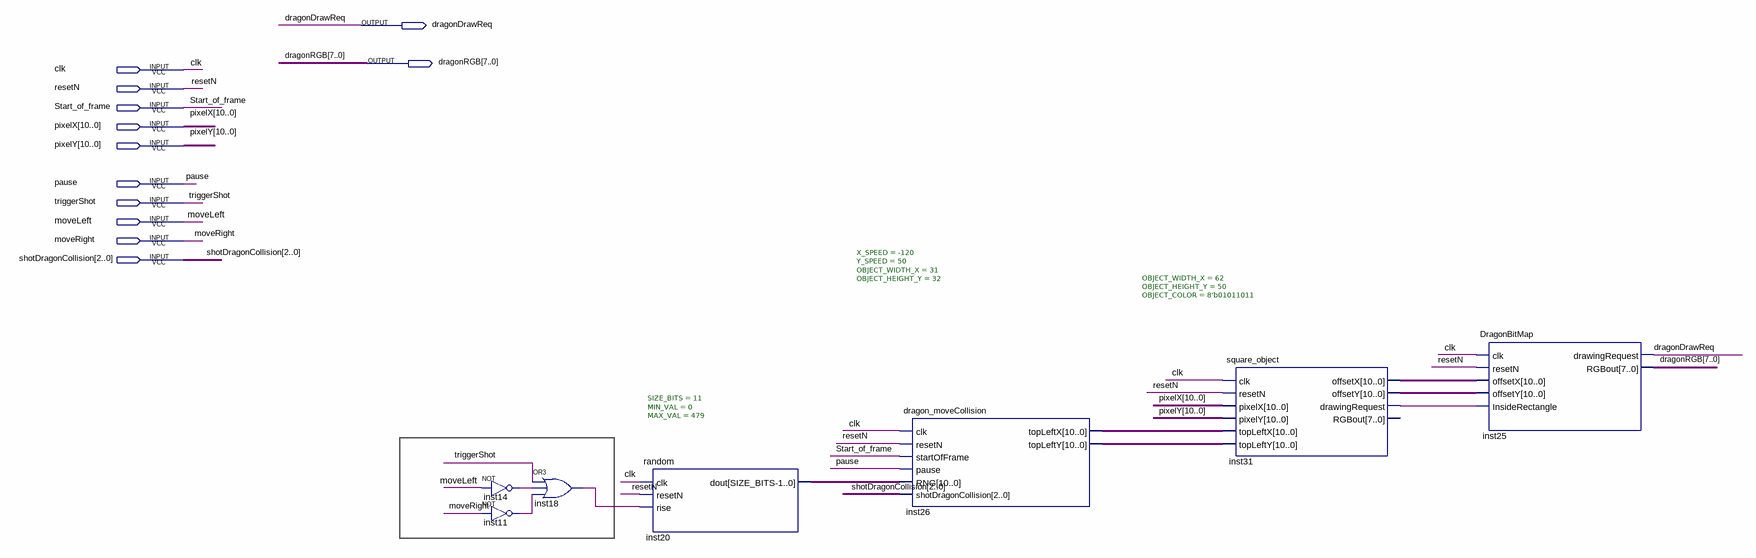
[diagram p0: schematic sheet]
// Quartus schematic TOP_DRAGON.bdf as structural Verilog: 7 symbols, 12 pins
module TOP_DRAGON (
  input  clk,
  input  resetN,
  input  Start_of_frame,
  input  [10:0] pixelX,
  input  [10:0] pixelY,
  input  pause,
  input  triggerShot,
  input  moveLeft,
  input  moveRight,
  input  [2:0] shotDragonCollision,
  output dragonDrawReq,
  output [7:0] dragonRGB
);

  wire inst11_out, inst14_out, inst18_out, inst31_drawingrequest;
  wire [10:0] inst20_dout, inst26_topleftx, inst26_toplefty, inst31_offsetx, inst31_offsety;

  not inst14 (inst14_out, moveLeft);
  not inst11 (inst11_out, moveRight);
  or inst18 (inst18_out, triggerShot, inst14_out, inst11_out);
  random #(.SIZE_BITS(11), .MIN_VAL(0), .MAX_VAL(479)) inst20 (
    .clk(clk), .resetN(resetN), .rise(inst18_out), .dout(inst20_dout));
  dragon_moveCollision #(.X_SPEED(-120), .Y_SPEED(50), .OBJECT_WIDTH_X(31), .OBJECT_HEIGHT_Y(32)) inst26 (
    .clk(clk), .resetN(resetN), .startOfFrame(Start_of_frame), .pause(pause), .RNG(inst20_dout),
    .shotDragonCollision(shotDragonCollision), .topLeftX(inst26_topleftx), .topLeftY(inst26_toplefty));
  square_object #(.OBJECT_WIDTH_X(62), .OBJECT_HEIGHT_Y(50), .OBJECT_COLOR(8'b01011011)) inst31 (
    .clk(clk), .resetN(resetN), .pixelX(pixelX), .pixelY(pixelY), .topLeftX(inst26_topleftx),
    .topLeftY(inst26_toplefty), .offsetX(inst31_offsetx), .offsetY(inst31_offsety),
    .drawingRequest(inst31_drawingrequest));  // open: RGBout
  DragonBitMap inst25 (
    .clk(clk), .resetN(resetN), .offsetX(inst31_offsetx), .offsetY(inst31_offsety),
    .InsideRectangle(inst31_drawingrequest), .drawingRequest(dragonDrawReq), .RGBout(dragonRGB));
endmodule
